# Altium schematic sheet core_app.SchDoc
size A4; SheetNumber: 2; SheetTotal: 5
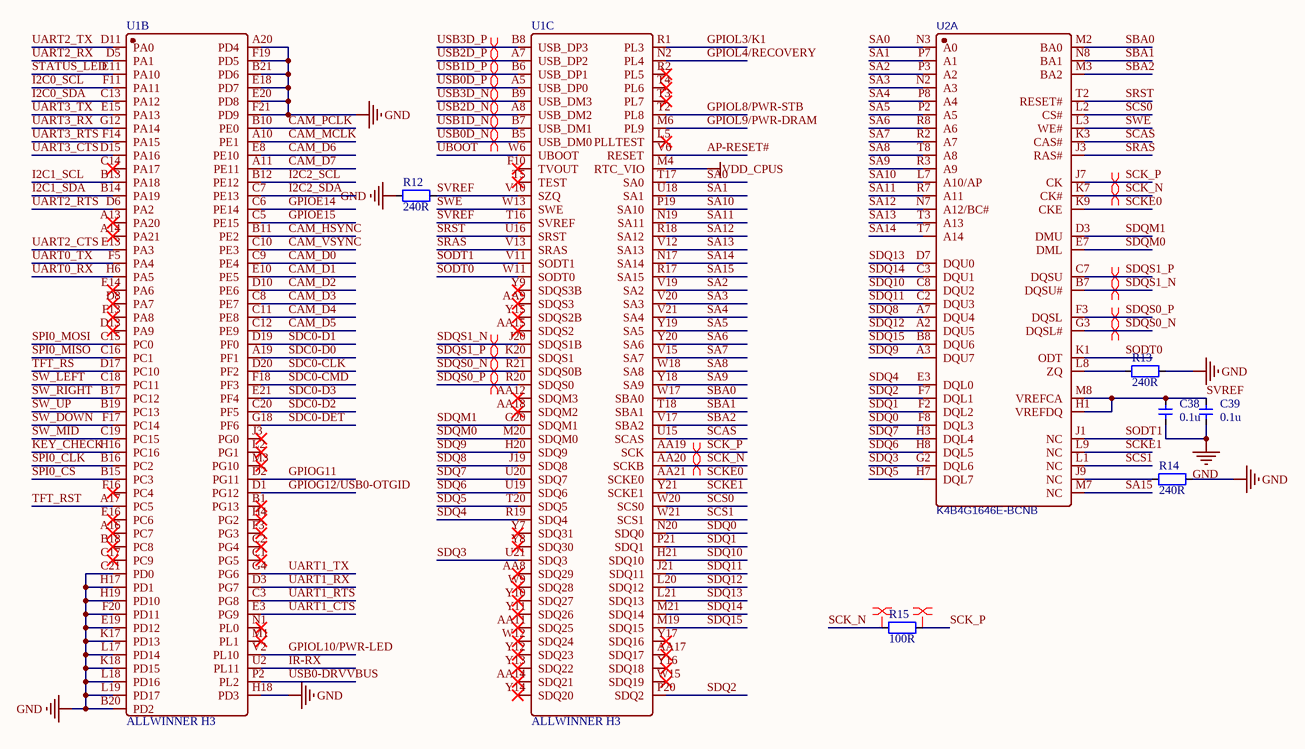
[diagram p0: core_app.SchDoc]

## Parts
C38  value 0.1u  [C0402]  (hidden comment: CAP-0402)
C39  value 0.1u  [C0402]  (hidden comment: CAP-0402)
R12  value 240R  [R0402]  (hidden comment: RES-0402)
R13  value 240R  [R0402]  (hidden comment: RES-0402)
R14  value 240R  [R0402]  (hidden comment: RES-0402)
R15  value 100R  [R0402]  (hidden comment: RES-0402)
U1  ALLWINNER H3  [BGA-347_L14.0-W14.0-R21-C21-P0.65-TL]  (parts B,C of 4)
U2  K4B4G1646E-BCNB  [FBGA-96_L13.5-W7.5-R16-C6-P0.80-TL]  (part A of 2)

## Nets
GND: C38.1 C39.1 R12.2 R13.1 R14.1 U1.A20(PD4) U1.B20(PD2) U1.B21(PD6) U1.C21(PD0) U1.E18(PD7) U1.E19(PD12) U1.E20(PD8) U1.F19(PD5) U1.F20(PD11) U1.F21(PD9) U1.H17(PD1) U1.H18(PD3) U1.H19(PD10) U1.K17(PD13) U1.K18(PD15) U1.L17(PD14) U1.L18(PD16) U1.L19(PD17)
VDD_CPUS: U1.M4(RTC_VIO)
AP-RESET#: U1.V6(RESET)
CAM_D0: U1.C9(PE4)
CAM_D1: U1.E10(PE5)
CAM_D2: U1.D10(PE6)
CAM_D3: U1.C8(PE7)
CAM_D4: U1.C11(PE8)
CAM_D5: U1.C12(PE9)
CAM_D6: U1.E8(PE10)
CAM_D7: U1.A11(PE11)
CAM_HSYNC: U1.B11(PE2)
CAM_MCLK: U1.A10(PE1)
CAM_PCLK: U1.B10(PE0)
CAM_VSYNC: U1.C10(PE3)
GPIOE14: U1.C6(PE14)
GPIOE15: U1.C5(PE15)
GPIOG11: U1.D2(PG11)
GPIOG12/USB0-OTGID: U1.D1(PG12)
GPIOL3/K1: U1.R1(PL3)
GPIOL4/RECOVERY: U1.N2(PL4)
GPIOL8/PWR-STB: U1.T2(PL8)
GPIOL9/PWR-DRAM: U1.M6(PL9)
GPIOL10/PWR-LED: U1.V2(PL10)
I2C0_SCL: U1.F11(PA11)
I2C0_SDA: U1.C13(PA12)
I2C1_SCL: U1.B13(PA18)
I2C1_SDA: U1.B14(PA19)
I2C2_SCL: U1.B12(PE12)
I2C2_SDA: U1.C7(PE13)
IR-RX: U1.U2(PL11)
KEY_CHECK: U1.H16(PC16)
SA0: U1.T17(SA0) U2.N3(A0)
SA1: U1.U18(SA1) U2.P7(A1)
SA2: U1.V19(SA2) U2.P3(A2)
SA3: U1.V20(SA3) U2.N2(A3)
SA4: U1.V21(SA4) U2.P8(A4)
SA5: U1.Y19(SA5) U2.P2(A5)
SA6: U1.Y20(SA6) U2.R8(A6)
SA7: U1.V15(SA7) U2.R2(A7)
SA8: U1.W18(SA8) U2.T8(A8)
SA9: U1.Y18(SA9) U2.R3(A9)
SA10: U1.P19(SA10) U2.L7(A10/AP)
SA11: U1.N19(SA11) U2.R7(A11)
SA12: U1.R18(SA12) U2.N7(A12/BC#)
SA13: U1.V12(SA13) U2.T3(A13)
SA14: U1.N17(SA14) U2.T7(A14)
SA15: U1.R17(SA15) U2.M7(NC)
SBA0: U1.W17(SBA0) U2.M2(BA0)
SBA1: U1.T18(SBA1) U2.N8(BA1)
SBA2: U1.V17(SBA2) U2.M3(BA2)
SCAS: U1.U15(SCAS) U2.K3(CAS#)
SCK_N: R15.2 U1.AA20(SCKB) U2.K7(CK#)
SCK_P: R15.1 U1.AA19(SCK) U2.J7(CK)
SCKE0: U1.AA21(SCKE0) U2.K9(CKE)
SCKE1: U1.Y21(SCKE1) U2.L9(NC)
SCS0: U1.W20(SCS0) U2.L2(CS#)
SCS1: U1.W21(SCS1) U2.L1(NC)
SDC0-CLK: U1.D20(PF2)
SDC0-CMD: U1.F18(PF3)
SDC0-D0: U1.A19(PF1)
SDC0-D1: U1.D19(PF0)
SDC0-D2: U1.C20(PF5)
SDC0-D3: U1.E21(PF4)
SDC0-DET: U1.G18(PF6)
SDQ0: U1.N20(SDQ0) U2.F8(DQL3)
SDQ1: U1.P21(SDQ1) U2.F2(DQL2)
SDQ2: U1.P20(SDQ2) U2.F7(DQL1)
SDQ3: U1.U21(SDQ3) U2.G2(DQL6)
SDQ4: U1.R19(SDQ4) U2.E3(DQL0)
SDQ5: U1.T20(SDQ5) U2.H7(DQL7)
SDQ6: U1.U19(SDQ6) U2.H8(DQL5)
SDQ7: U1.U20(SDQ7) U2.H3(DQL4)
SDQ8: U1.J19(SDQ8) U2.A7(DQU4)
SDQ9: U1.H20(SDQ9) U2.A3(DQU7)
SDQ10: U1.H21(SDQ10) U2.C8(DQU2)
SDQ11: U1.J21(SDQ11) U2.C2(DQU3)
SDQ12: U1.L20(SDQ12) U2.A2(DQU5)
SDQ13: U1.L21(SDQ13) U2.D7(DQU0)
SDQ14: U1.M21(SDQ14) U2.C3(DQU1)
SDQ15: U1.M19(SDQ15) U2.B8(DQU6)
SDQM0: U1.M20(SDQM0) U2.E7(DML)
SDQM1: U1.G20(SDQM1) U2.D3(DMU)
SDQS0_N: U1.R21(SDQS0B) U2.G3(DQSL#)
SDQS0_P: U1.R20(SDQS0) U2.F3(DQSL)
SDQS1_N: U1.J20(SDQS1B) U2.B7(DQSU#)
SDQS1_P: U1.K20(SDQS1) U2.C7(DQSU)
SODT0: U1.W11(SODT0) U2.K1(ODT)
SODT1: U1.V11(SODT1) U2.J1(NC)
SPI0_CLK: U1.B16(PC2)
SPI0_CS: U1.B15(PC3)
SPI0_MISO: U1.C16(PC1)
SPI0_MOSI: U1.C15(PC0)
SRAS: U1.V13(SRAS) U2.J3(RAS#)
SRST: U1.U16(SRST) U2.T2(RESET#)
STATUS_LED: U1.E11(PA10)
SVREF: C38.2 C39.2 R12.1 U1.T16(SVREF) U1.V10(SZQ) U2.H1(VREFDQ) U2.M8(VREFCA)
SW_DOWN: U1.F17(PC14)
SW_LEFT: U1.C18(PC11)
SW_MID: U1.C19(PC15)
SW_RIGHT: U1.B17(PC12)
SW_UP: U1.B19(PC13)
SWE: U1.W13(SWE) U2.L3(WE#)
TFT_RS: U1.D17(PC10)
TFT_RST: U1.A17(PC5)
UART0_RX: U1.H6(PA5)
UART0_TX: U1.F5(PA4)
UART1_CTS: U1.E3(PG9)
UART1_RTS: U1.C3(PG8)
UART1_RX: U1.D3(PG7)
UART1_TX: U1.G4(PG6)
UART2_CTS: U1.E13(PA3)
UART2_RTS: U1.D6(PA2)
UART2_RX: U1.D5(PA1)
UART2_TX: U1.D11(PA0)
UART3_CTS: U1.D15(PA16)
UART3_RTS: U1.F14(PA15)
UART3_RX: U1.G12(PA14)
UART3_TX: U1.E15(PA13)
UBOOT: U1.W6(UBOOT)
USB0-DRVVBUS: U1.P2(PL2)
USB0D_N: U1.B5(USB_DM0)
USB0D_P: U1.A5(USB_DP0)
USB1D_N: U1.B7(USB_DM1)
USB1D_P: U1.B6(USB_DP1)
USB2D_N: U1.A8(USB_DM2)
USB2D_P: U1.A7(USB_DP2)
USB3D_N: U1.B9(USB_DM3)
USB3D_P: U1.B8(USB_DP3)
NetR13_2: R13.2 U2.L8(ZQ)
NetR14_2: R14.2 U2.J9(NC)

Not connected (* = marked no-connect by the designer): U1 A13(PA20)* A14(PA21)* A16(PC7)* AA8(SDQ29)* AA9(SDQS3)* AA11(SDQ25)* AA12(SDQM3)* AA14(SDQ21)* AA15(SDQS2)* AA17(SDQ17)* AA18(SDQM2)* B1(PG13)* B18(PC8)* C1(PG5)* C2(PG4)* C14(PA17)* C17(PC9)* D8(PA7)* D13(PA9)* E14(PA6)* E16(PC6)* F3(PG3)* F10(TVOUT)* F13(PA8)* F16(PC4)* H4(PG2)* J3(PG0)* L2(PG1)* L5(PLLTEST)* M1(PL1)* M3(PG10)* N1(PL0)* R2(PL5)* T3(PL7)* T4(PL6)* T5(TEST)* W9(SDQ28)* W12(SDQ24)* W15(SDQ19)* Y7(SDQ31)* Y8(SDQ30)* Y9(SDQS3B)* Y10(SDQ27)* Y11(SDQ26)* Y12(SDQ23)* Y13(SDQ22)* Y14(SDQ20)* Y15(SDQS2B)* Y16(SDQ18)* Y17(SDQ16)*

## Layout directives
differential pair: SCK_N, SCK_P, SDQS0_N, SDQS0_P, SDQS1_N, SDQS1_P, USB0D_N, USB0D_P, USB1D_N, USB1D_P, USB2D_N, USB2D_P, USB3D_N, USB3D_P

## Library data of the parts
C38 C39 = CAP-0402: Capacitor
R12-R15 = RES-0402: Resistor
U2 = K4B4G1646E-BCNB: BOM_Manufacturer: SAMSUNG(三星半导体); Contributor: LCSC; BOM_Supplier Part: C2803248; BOM_Manufacturer Part: K4B4G1646E-BCNB; BOM_JLCPCB Part Class: Extended Part; spicePre: U; spiceSymbolName: K4B4G1646E-BCNB; BOM_Supplier: LCSC